# EAGLE design small (EAGLE 6.1)
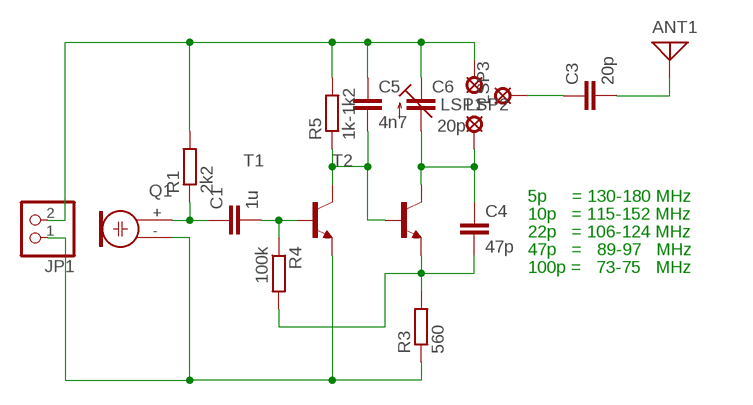
[diagram p0: schematic, sheet 1]

## Parts
ANT1  ANTENNA  [PAD-01]
C1  1u  C-EU025-025X050  [C025-025X050]
C3  20p  C-EU025-025X050  [C025-025X050]
C4  47p  C-EU025-025X050  [C025-025X050]
C5  4n7  C-EU025-025X050  [C025-025X050]
C6  20p  C-TRIMM808  [CTRIM808-BC]
JP1  PINHD-1X2  [1X02]
LSP1  SE14  [SE14]
LSP2  SE14  [SE14]
LSP3  SE14  [SE14]
Q1  ELECTRET  [9.7ELECTRET]
R1  2k2  R-EU_0207/2V  [0207/2V]
R3  560  R-EU_0207/2V  [0207/2V]
R4  100k  R-EU_0207/2V  [0207/2V]
R5  1k-1k2  R-EU_0207/2V  [0207/2V]
T1  BC547-NPN-TO92-CBE  [TO92-CBE]
T2  BC547-NPN-TO92-CBE  [TO92-CBE]

## Nets
GND: JP1.1 Q1.- R3.1 T1.E
N$1: C1.1 Q1.+ R1.1
N$2: C1.2 R4.1 T1.B
N$3: C4.2 R3.2 R4.2 T2.E
N$4: C5.2 R5.1 T1.C T2.B
N$5: C4.1 C6.2(A) LSP2.MP T2.C
N$6: C3.1 LSP3.MP
N$8: C5.1 C6.1(E) JP1.2 LSP1.MP R1.2 R5.2
N$13: ANT1.1 C3.2

## Notes on the sheet
- 5p     = 130-180 MHz
- 10p   = 115-152 MHz
- 22p   = 106-124 MHz
- 47p   =   89-97   MHz
- 100p =   73-75   MHz

## Library data of the parts
ANT1 = discrete:ANTENNA: Antenna
C1 C3-C5 = rcl:C-EU: CAPACITOR, European symbol
C6 = rcl:C-TRIMM: Trimm capacitor
JP1 = pinhead:PINHD-1X2: PIN HEADER
LSP1-LSP3 = solpad:SE14: SOLDER PAD E1553, drill 1,4mm, distributor Buerklin, 07F820
Q1 = adafruit:ELECTRET: Electret microphone Thru hole 2.54mm spacing with 9.7mm diameter
R1 R3-R5 = rcl:R-EU_: RESISTOR, European symbol
T1 T2 = transistor:*-NPN-: NPN Transistror BF959 corrected 2008.03.06

## Board
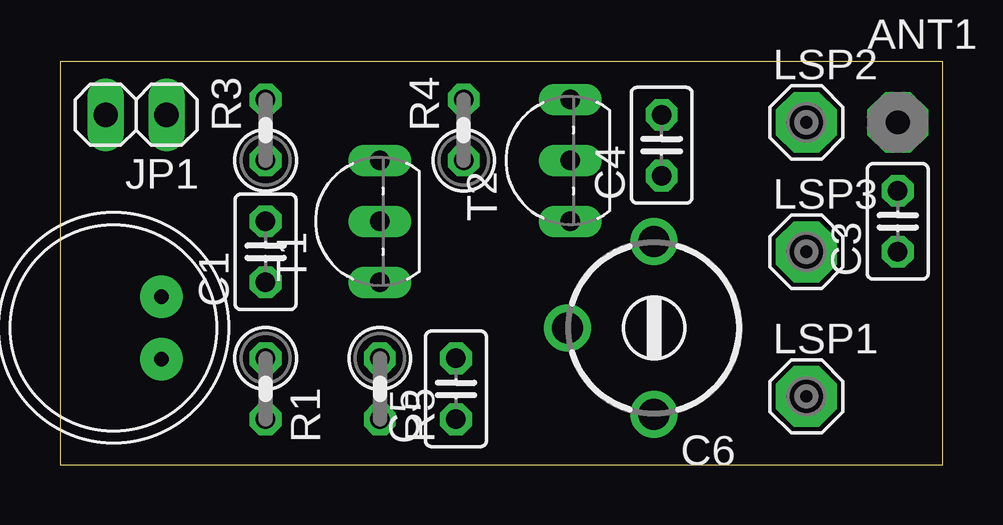
[diagram p1: board, top side]
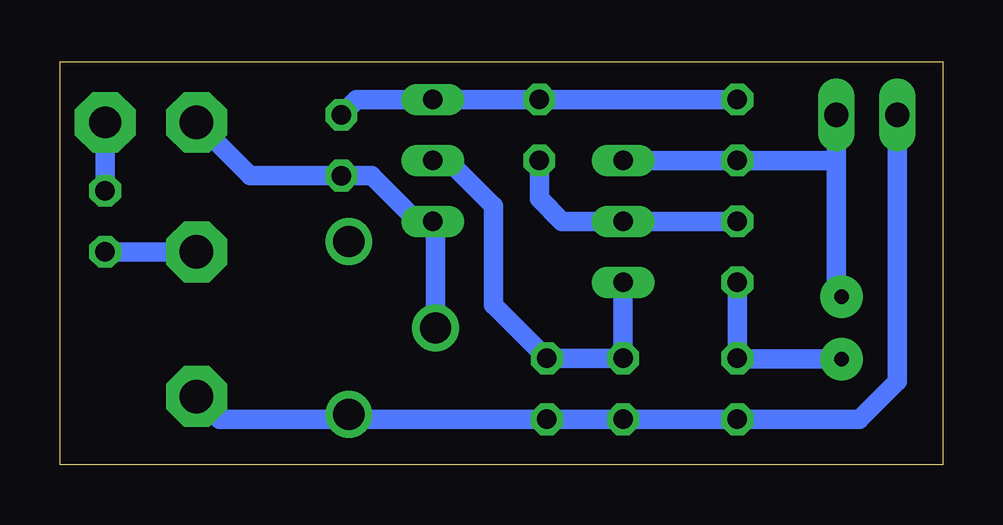
[diagram p2: board, bottom side, seen from below]

Size 36.81 x 16.82 mm. Coordinates in mm from the lower left corner, seen from the top.
Outline: 0,0 36.81,0 36.81,16.82 0,16.82 0,0
Copper layers (1*16): Top 0.035mm / dielectric 1.5mm / Bottom 0.035mm
Design rules: minimum track width 10mil, minimum drill 24mil, track to track 8mil, track to pad 8mil, pad to pad 8mil, via to via 8mil, smd to smd 8mil, copper to edge 40mil, drill to drill 8mil, minimum pad ring 10mil, minimum via ring 8mil, stop-mask expansion 4mil, vias tented up to drill 0mil, thermal gap 10mil

### Footprints (pad centres in the part's own frame; a part is rotated, then mirrored left to right if it is on the bottom)
PAD-01 = drill 1.321 pad 2.54 octagon: 1 0,0
C025-025X050 = drill 0.813 octagon: 1 -1.27,0; 2 1.27,0
CTRIM808-BC = drill 1.3: 1 -3.607,0; 2 0,3.607; 3 3.607,0
1X02 = drill 1.016 long: 1 -1.27,0; 2 1.27,0
SE14 = drill 1.397 pad 2.54 octagon: MP 0,0
9.7ELECTRET = drill 0.6 pad 1.778: + 1.3,2; - -1.3,2
0207/2V = drill 0.813 octagon: 1 -1.27,0; 2 1.27,0
TO92-CBE = drill 0.813 long: B 0,0; C -2.54,0; E 2.54,0

### Placement (x,y rotation side)
ANT1  34.92,14.29 0 top
C1  8.57,8.89 90 top
C3  34.92,10.16 90 top
C4  25.08,13.34 90 top
C5  16.51,3.17 90 top
C6  24.77,5.71 90 top
JP1  3.17,14.61 180 top
LSP1  31.11,2.86 0 top
LSP2  31.11,14.29 0 top
LSP3  31.11,8.89 0 top
Q1  2.22,5.71 270 top
R1  8.57,3.17 270 top
R3  8.57,13.97 90 top
R4  16.83,13.97 90 top
R5  13.34,3.17 270 top
T1  13.34,10.16 90 top
T2  21.27,12.7 90 top

### Tracks (layer width: path | path; a pad name or v marks a point on that pad's centre or on a via)
GND
  Bottom 0.813: T1.E R3.1 4.45,12.7 | JP1.1 4.45,12.7 | 4.45,12.7 4.45,7.24 Q1.-
N$1
  Bottom 0.813: Q1.+ 8.54,4.42 R1.1 C1.1
N$2
  Bottom 0.813: C1.2 T1.B 15.88,10.16 16.83,11.11 R4.1
N$3
  Bottom 0.813: R3.2 R4.2 T2.E 24.45,15.24 C4.2
N$4
  Bottom 0.813: T1.C R5.1 C5.2 18.73,6.67 18.73,10.79 20.64,12.7 T2.B
N$5
  Bottom 0.813: C6.2 21.16,9.96 20.95,10.16 T2.C 21.91,10.16 23.81,12.06 C4.1 28.89,12.06 LSP2.MP
N$6
  Bottom 0.813: LSP3.MP C3.1
N$8
  Bottom 0.813: 24.77,1.91 C5.1 R5.2 R1.2 3.49,1.91 1.91,3.49 JP1.2 | 24.77,1.91 30.16,1.91 LSP1.MP | C6.1 24.56,2.11 24.77,1.91
N$13
  Bottom 0.813: C3.2 ANT1.1